# Altium schematic sheet 03_MCU.SchDoc
size A; SheetNumber: 1; SheetTotal: 3
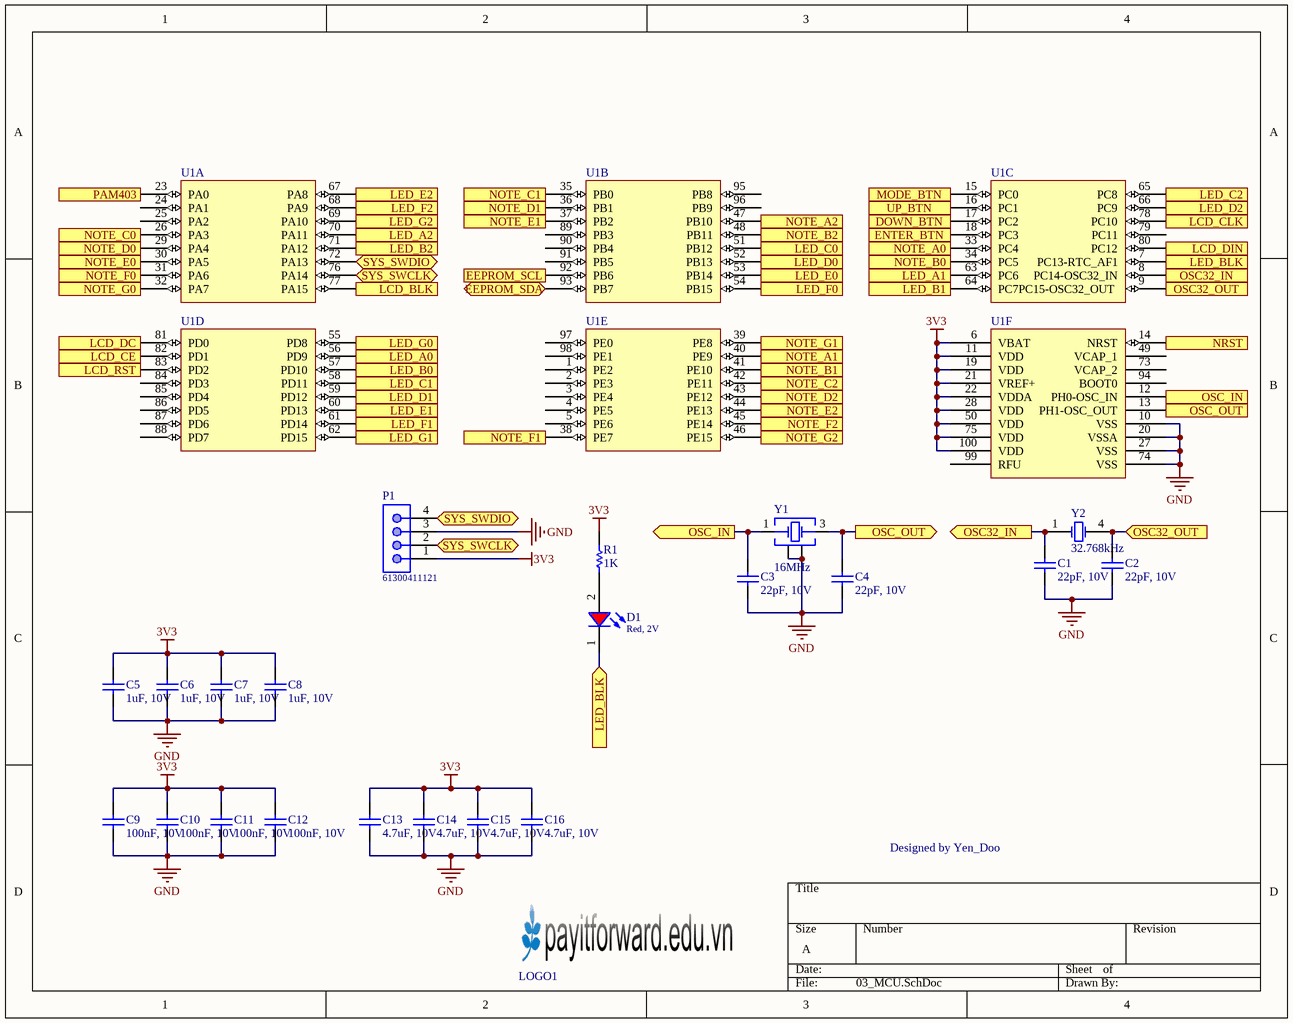
[diagram p0: 03_MCU.SchDoc]

## Parts
*  LOGO_DOO  [Logo_Top_Overlay]  (value not drawn)
C1  22pF, 10V  [WCAP-CSGP_0603_H=0.8mm_Reflow]
C2  22pF, 10V  [WCAP-CSGP_0603_H=0.8mm_Reflow]
C3  22pF, 10V  [WCAP-CSGP_0603_H=0.8mm_Reflow]
C4  22pF, 10V  [WCAP-CSGP_0603_H=0.8mm_Reflow]
C5  1uF, 10V  [WCAP-CSGP_0603_H=0.8mm_Reflow]
C6  1uF, 10V  [WCAP-CSGP_0603_H=0.8mm_Reflow]
C7  1uF, 10V  [WCAP-CSGP_0603_H=0.8mm_Reflow]
C8  1uF, 10V  [WCAP-CSGP_0603_H=0.8mm_Reflow]
C9  100nF, 10V  [WCAP-CSGP_0603_H=0.8mm_Reflow]
C10  100nF, 10V  [WCAP-CSGP_0603_H=0.8mm_Reflow]
C11  100nF, 10V  [WCAP-CSGP_0603_H=0.8mm_Reflow]
C12  100nF, 10V  [WCAP-CSGP_0603_H=0.8mm_Reflow]
C13  4.7uF, 10V  [WCAP-CSGP_0603_H=0.8mm_Reflow]
C14  4.7uF, 10V  [WCAP-CSGP_0603_H=0.8mm_Reflow]
C15  4.7uF, 10V  [WCAP-CSGP_0603_H=0.8mm_Reflow]
C16  4.7uF, 10V  [WCAP-CSGP_0603_H=0.8mm_Reflow]
D1  Red, 2V  [WL-SMCW_0603_H=0.7mm]
LOGO1  LOGO PIF  [PIF LOGO BIG SSTOP]  (value not drawn)
P1  61300411121  [61300411121]
R1  value 1K  [RES-SM-0603]  (hidden comment: RESISTOR SMD)
U1  STM32F205VCT6  [STM32F205VCT6]  (value not drawn)  (parts A,B,C,D,E,F of 6)
Y1  16MHz  [WE-XTAL_12SMX]
Y2  32.768kHz  [WE-XTAL_85SMX]

## Ports
DOWN_BTN (in), EEPROM_SCL (out), EEPROM_SDA (bidir), ENTER_BTN (in), LCD_BLK (out), LCD_CE (out), LCD_CLK (out), LCD_DC (out), LCD_DIN (in), LCD_RST (out), LED_A0 (out), LED_A1 (out), LED_A2 (out), LED_B0 (out), LED_B1 (out), LED_B2 (out), LED_BLK (in), LED_BLK (out), LED_C0 (out), LED_C1 (out), LED_C2 (out), LED_D0 (out), LED_D1 (out), LED_D2 (out), LED_E0 (out), LED_E1 (out), LED_E2 (out), LED_F0 (out), LED_F1 (out), LED_F2 (out), LED_G0 (out), LED_G1 (out), LED_G2 (out), MODE_BTN (in), NOTE_A0 (in), NOTE_A1 (in), NOTE_A2 (in), NOTE_B0 (in), NOTE_B1 (in), NOTE_B2 (in), NOTE_C0 (in), NOTE_C1 (in), NOTE_C2 (in), NOTE_D0 (in), NOTE_D1 (in), NOTE_D2 (in), NOTE_E0 (in), NOTE_E1 (in), NOTE_E2 (in), NOTE_F0 (in), NOTE_F1 (in), NOTE_F2 (in), NOTE_G0 (in), NOTE_G1 (in), NOTE_G2 (in), NRST (in), OSC32_IN (in), OSC32_IN (out), OSC32_OUT (in), OSC32_OUT (out), OSC_IN (in), OSC_IN (out), OSC_OUT (out), PAM403 (out), SYS_SWCLK (bidir), SYS_SWDIO (bidir), UP_BTN (in)

## Nets
3V3: C5.2 C6.2 C7.2 C8.2 C9.2 C10.2 C11.2 C12.2 C13.1 C14.1 C15.1 C16.1 P1.1 R1.2 U1.6(VBAT) U1.11(VDD) U1.19(VDD) U1.21(VREF+) U1.22(VDDA) U1.28(VDD) U1.50(VDD) U1.75(VDD) U1.100(VDD)
GND: C1.1 C2.1 C3.1 C4.1 C5.1 C6.1 C7.1 C8.1 C9.1 C10.1 C11.1 C12.1 C13.2 C14.2 C15.2 C16.2 P1.3 U1.10(VSS) U1.20(VSSA) U1.27(VSS) U1.74(VSS) Y1.2(GND_&_Lid) Y1.4(GND_&_Lid)
DOWN_BTN: U1.17(PC2) ; port DOWN_BTN
EEPROM_SCL: U1.92(PB6) ; port EEPROM_SCL
EEPROM_SDA: U1.93(PB7) ; port EEPROM_SDA
ENTER_BTN: U1.18(PC3) ; port ENTER_BTN
LCD_BLK: U1.77(PA15) ; port LCD_BLK
LCD_CE: U1.82(PD1) ; port LCD_CE
LCD_CLK: U1.78(PC10) ; port LCD_CLK
LCD_DC: U1.81(PD0) ; port LCD_DC
LCD_DIN: U1.80(PC12) ; port LCD_DIN
LCD_RST: U1.83(PD2) ; port LCD_RST
LED_A0: U1.56(PD9) ; port LED_A0
LED_A1: U1.63(PC6) ; port LED_A1
LED_A2: U1.70(PA11) ; port LED_A2
LED_B0: U1.57(PD10) ; port LED_B0
LED_B1: U1.64(PC7) ; port LED_B1
LED_B2: U1.71(PA12) ; port LED_B2
LED_BLK: D1.1(K) U1.7(PC13-RTC_AF1) ; port LED_BLK
LED_C0: U1.51(PB12) ; port LED_C0
LED_C1: U1.58(PD11) ; port LED_C1
LED_C2: U1.65(PC8) ; port LED_C2
LED_D0: U1.52(PB13) ; port LED_D0
LED_D1: U1.59(PD12) ; port LED_D1
LED_D2: U1.66(PC9) ; port LED_D2
LED_E0: U1.53(PB14) ; port LED_E0
LED_E1: U1.60(PD13) ; port LED_E1
LED_E2: U1.67(PA8) ; port LED_E2
LED_F0: U1.54(PB15) ; port LED_F0
LED_F1: U1.61(PD14) ; port LED_F1
LED_F2: U1.68(PA9) ; port LED_F2
LED_G0: U1.55(PD8) ; port LED_G0
LED_G1: U1.62(PD15) ; port LED_G1
LED_G2: U1.69(PA10) ; port LED_G2
MODE_BTN: U1.15(PC0) ; port MODE_BTN
NOTE_A0: U1.33(PC4) ; port NOTE_A0
NOTE_A1: U1.40(PE9) ; port NOTE_A1
NOTE_A2: U1.47(PB10) ; port NOTE_A2
NOTE_B0: U1.34(PC5) ; port NOTE_B0
NOTE_B1: U1.41(PE10) ; port NOTE_B1
NOTE_B2: U1.48(PB11) ; port NOTE_B2
NOTE_C0: U1.26(PA3) ; port NOTE_C0
NOTE_C1: U1.35(PB0) ; port NOTE_C1
NOTE_C2: U1.42(PE11) ; port NOTE_C2
NOTE_D0: U1.29(PA4) ; port NOTE_D0
NOTE_D1: U1.36(PB1) ; port NOTE_D1
NOTE_D2: U1.43(PE12) ; port NOTE_D2
NOTE_E0: U1.30(PA5) ; port NOTE_E0
NOTE_E1: U1.37(PB2) ; port NOTE_E1
NOTE_E2: U1.44(PE13) ; port NOTE_E2
NOTE_F0: U1.31(PA6) ; port NOTE_F0
NOTE_F1: U1.38(PE7) ; port NOTE_F1
NOTE_F2: U1.45(PE14) ; port NOTE_F2
NOTE_G0: U1.32(PA7) ; port NOTE_G0
NOTE_G1: U1.39(PE8) ; port NOTE_G1
NOTE_G2: U1.46(PE15) ; port NOTE_G2
NRST: U1.14(NRST) ; port NRST
OSC32_IN: C1.2 U1.8(PC14-OSC32_IN) Y2.1(Crystal) ; port OSC32_IN
OSC32_OUT: C2.2 U1.9(PC15-OSC32_OUT) Y2.4(Crystal) ; port OSC32_OUT
OSC_IN: C3.2 U1.12(PH0-OSC_IN) Y1.1(Crystal) ; port OSC_IN
OSC_OUT: C4.2 U1.13(PH1-OSC_OUT) Y1.3(Crystal) ; port OSC_OUT
PAM403: U1.23(PA0) ; port PAM403
SYS_SWCLK: P1.2 U1.76(PA14) ; port SYS_SWCLK
SYS_SWDIO: P1.4 U1.72(PA13) ; port SYS_SWDIO
UP_BTN: U1.16(PC1) ; port UP_BTN
NetD1_2: D1.2(A) R1.1

Not connected (* = marked no-connect by the designer): U1 1(PE2) 2(PE3) 3(PE4) 4(PE5) 5(PE6) 24(PA1) 25(PA2) 49(VCAP_1) 73(VCAP_2) 79(PC11) 84(PD3) 85(PD4) 86(PD5) 87(PD6) 88(PD7) 89(PB3) 90(PB4) 91(PB5) 94(BOOT0) 95(PB8) 96(PB9) 97(PE0) 98(PE1) 99(RFU)

## Notes on the sheet
- (in symbol LOGO_DOO) Designed by Yen_Doo

## Library data of the parts
C1-C4 = 885012006004: WCAP-CSGP Multilayer Ceramic Chip Capacitor, General Purpose, size 0603, NP0, 22pF, 10V; Manufacturer: Wurth Elektronik; Rated Voltage: 10VDC; Isolation Resistance: >=10GOhm; Capacitance Tolerance: +/-5%; Dissipation Factor: Q>=400+20C; Technical Reference: NP00603220J010DFCT10000; ComponentLink1Description: Manufacturer; ComponentLink1URL: http://www.we-online.de; ComponentLink2Description: Datasheet; ComponentLink2URL: https://www.we-online.com/catalog/datasheet/885012006004.pdf; Operating Temperature: -55 to +125degC; Packaging: Tape and Reel; Manufacturer Part Number: 885012006004; Published Date: May 2020; Ceramic Type: NP0; Height: 0.8mm; Mounting Technology: SMT; Size: 0603; Capacitance: 22pF
C5-C8 = 885012106010: WCAP-CSGP Multilayer Ceramic Chip Capacitor, General Purpose, size 0603, X5R, 1uF, 10V; Manufacturer: Wurth Elektronik; Rated Voltage: 10VDC; Isolation Resistance: >=0.1GOhm; Capacitance Tolerance: +/-20%; Technical Reference: X5R0603105M010DFCT10000; ComponentLink1Description: Manufacturer; ComponentLink1URL: http://www.we-online.de; ComponentLink2Description: Datasheet; ComponentLink2URL: https://www.we-online.com/catalog/datasheet/885012106010.pdf; Operating Temperature: -55 to +85degC; Packaging: Tape and Reel; Manufacturer Part Number: 885012106010; Published Date: May 2020; Ceramic Type: X5R; Dissipation Factor: =<10%; Height: 0.8mm; Mounting Technology: SMT; Size: 0603; Capacitance: 1uF
C9-C12 = 885012206020: WCAP-CSGP Multilayer Ceramic Chip Capacitor, General Purpose, size 0603, X7R, 100nF, 10V; Manufacturer: Wurth Elektronik; Rated Voltage: 10VDC; Isolation Resistance: >=5GOhm; Capacitance Tolerance: +/-10%; Technical Reference: X7R0603104K010DFCT10000; ComponentLink1Description: Manufacturer; ComponentLink1URL: http://www.we-online.de; ComponentLink2Description: Datasheet; ComponentLink2URL: https://www.we-online.com/catalog/datasheet/885012206020.pdf; Operating Temperature: -55 to +125degC; Packaging: Tape and Reel; Manufacturer Part Number: 885012206020; Published Date: May 2020; Ceramic Type: X7R; Dissipation Factor: =<5%; Height: 0.8mm; Mounting Technology: SMT; Size: 0603; Capacitance: 100nF
C13-C16 = 885012106012: WCAP-CSGP Multilayer Ceramic Chip Capacitor, General Purpose, size 0603, X5R, 4.7uF, 10V; Manufacturer: Wurth Elektronik; Rated Voltage: 10VDC; Isolation Resistance: >=0.02GOhm; Capacitance Tolerance: +/-20%; Technical Reference: X5R0603475M010DFCT10000; ComponentLink1Description: Manufacturer; ComponentLink1URL: http://www.we-online.de; ComponentLink2Description: Datasheet; ComponentLink2URL: https://www.we-online.com/catalog/datasheet/885012106012.pdf; Operating Temperature: -55 to +85degC; Packaging: Tape and Reel; Manufacturer Part Number: 885012106012; Published Date: May 2020; Ceramic Type: X5R; Dissipation Factor: =<10%; Height: 0.8mm; Mounting Technology: SMT; Size: 0603; Capacitance: 4.7uF
D1 = 150060RS75000: WL-SMCW SMT Mono-color Chip LED Waterclear, size 0603, Red, 2V, 140deg; Chip Technology: AlInGaP; Dominant Wavelength typ.: 625nm; Luminous Intensity typ.: 250mcd; Peak Wavelength typ.: 630nm; Viewing Angle: 140deg; ComponentLink1Description: Manufacturer; ComponentLink1URL: http://www.we-online.de; ComponentLink2URL: https://www.we-online.com/catalog/datasheet/150060RS75000.pdf; ComponentLink2Description: Datasheet; Forward Voltage typ.: 2V; Emitting Color: Red; Mounting Technology: SMT; Operating Temperature: -40 to +85degC; Published Date: December 2019; Part Number: 150060RS75000; Packaging: Tape and Reel; Size: 0603; Publisher: Wurth Elektronik
P1 = 61300411121: WR-PHD Pin Header, THT, pitch 2.54mm, Single Row, Vertical, 4p; Manufacturer: Wurth Elektronik; Pin Number: 4; Rated Current: 3A; Working Voltage: 250VAC; Withstanding Voltage: 500VAC; Contact Resistance: 20mOhm; ComponentLink1Description: Manufacturer; ComponentLink1URL: http://www.we-online.de; ComponentLink2Description: Datasheet; ComponentLink2URL: https://www.we-online.com/catalog/datasheet/61300411121.pdf; Manufacturer Part Number: 61300411121; Published Date: May 2020; Pitch: 2.54mm; Operating Temperature: -40 to +105degC; Mounting Technology: THT; Packaging: Bag; Gender: Pin Header; Row Number: Single; Orientation: Vertical
R1 = RESISTOR SMD: Resistor
U1 = STM32F205VCT6: ARM® Cortex®-M3 STM32F2 Microcontroller IC 32-Bit Single-Core 120MHz 256KB (256K x 8) FLASH 100-LQFP (14x14); Mfr: STMicroelectronics; Connectivity: CANbus, I²C, IrDA, LINbus, MMC, SPI, UART/USART, USB OTG; Peripherals: Brown-out Detect/Reset, DMA, I²S, LCD, POR, PWM, WDT; Number of I/O: 82; RAM Size: 100K x 8; Voltage - Supply (Vcc/Vdd): 1.8V ~ 3.6V; Data Converters: /D 16x12b; D/A 2x12b; Oscillator Type: Internal; Series: STM32F2; Core Processor: ARM® Cortex®-M3; Core Size: 32-Bit Single-Core; Speed: 120MHz; Program Memory Size: 256KB (256K x 8); Program Memory Type: FLASH; Operating Temperature: -40°C ~ 85°C (TA); Mounting Type: Surface Mount; Package / Case: 100-LQFP; Supplier Device Package: 100-LQFP (14x14); Base Product Number: STM32F205; ComponentLink1Description: Digikey; ComponentLink1URL: https://www.digikey.com/en/products/detail/stmicroelectronics/STM32F205VCT6/2640805
Y1 = 830026392: WE-XTAL Quartz Crystal, SMT, 12SMX, 16MHz, +/-30ppm; Manufacturer: Wurth Elektronik; Frequency Stability: +/-50ppm; Load Capacitance: 16pF; ComponentLink1Description: Manufacturer; ComponentLink1URL: http://www.we-online.de; ComponentLink2Description: Datasheet; ComponentLink2URL: https://katalog.we-online.com/pbs/datasheet/830026392.pdf; Operating Temperature: -20 to +70degC; Packaging: Tape and Reel; Manufacturer Part Number: 830026392; Published Date: July 2020; Size: 12SMX; Frequency: 16MHz; Frequency Tolerance: +/-30ppm; Mounting Technology: SMT
Y2 = 830016178: WE-XTAL Watch Crystal, SMT, 85SMX, 32.768kHz, +/-20ppm; Manufacturer: Wurth Elektronik; Load Capacitance: 6pF; ComponentLink1Description: Manufacturer; ComponentLink1URL: http://www.we-online.de; ComponentLink2Description: Datasheet; ComponentLink2URL: https://katalog.we-online.com/pbs/datasheet/830016178.pdf; Operating Temperature: -40 to +85degC; Packaging: Tape and Reel; Manufacturer Part Number: 830016178; Published Date: July 2020; Size: 85SMX; Frequency Stability: -; Frequency: 32.768kHz; Frequency Tolerance: +/-20ppm; Mounting Technology: SMT